# Altium schematic sheet JTAG_Adapter.SchDoc
size A4; SheetNumber: 1; SheetTotal: 1
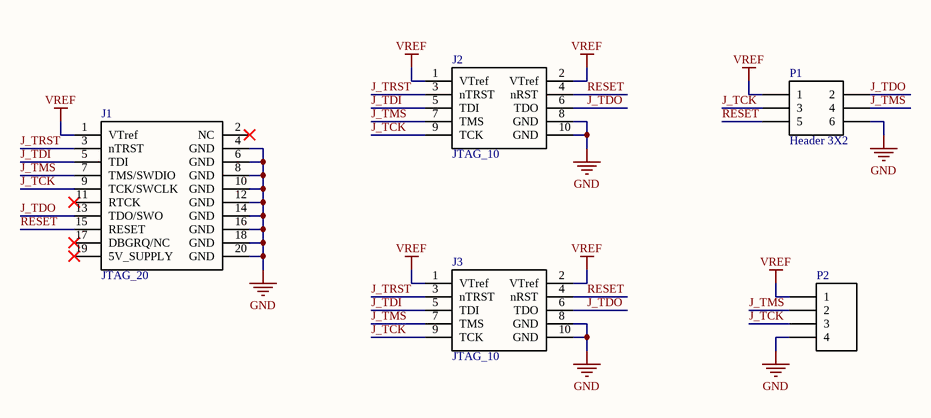
[diagram p0: JTAG_Adapter.SchDoc]

## Parts
J1  JTAG_20  [JTAG_20]
J2  JTAG_10  [JTAG_10]
J3  JTAG_10  [JTAG_10]
P1  Header 3X2  [DIP6-2.00-BH2]
P2  Header 4  [XH2.54_4P]  (value not drawn)

## Nets
GND: J1.4(GND) J1.6(GND) J1.8(GND) J1.10(GND) J1.12(GND) J1.14(GND) J1.16(GND) J1.18(GND) J1.20(GND) J2.8(GND) J2.10(GND) J3.8(GND) J3.10(GND) P1.6 P2.4
VREF: J1.1(VTref) J2.1(VTref) J2.2(VTref) J3.1(VTref) J3.2(VTref) P1.1 P2.1
J_TCK: J1.9(TCK/SWCLK) J2.9(TCK) J3.9(TCK) P1.3 P2.3
J_TDI: J1.5(TDI) J2.5(TDI) J3.5(TDI)
J_TDO: J1.13(TDO/SWO) J2.6(TDO) J3.6(TDO) P1.2
J_TMS: J1.7(TMS/SWDIO) J2.7(TMS) J3.7(TMS) P1.4 P2.2
J_TRST: J1.3(nTRST) J2.3(nTRST) J3.3(nTRST)
RESET: J1.15(RESET) J2.4(nRST) J3.4(nRST) P1.5

Not connected (* = marked no-connect by the designer): J1 2(NC)* 11(RTCK)* 17(DBGRQ/NC)* 19(5V_SUPPLY)*

## Library data of the parts
P1 = Header 3X2: Header, 3-Pin, Dual row
P2 = Header 4: Header, 4-Pin; LatestRevisionDate: 17-Jul-2002; LatestRevisionNote: Re-released for DXP Platform.; Publisher: Altium Limited